# Altium project usb.PrjPcb
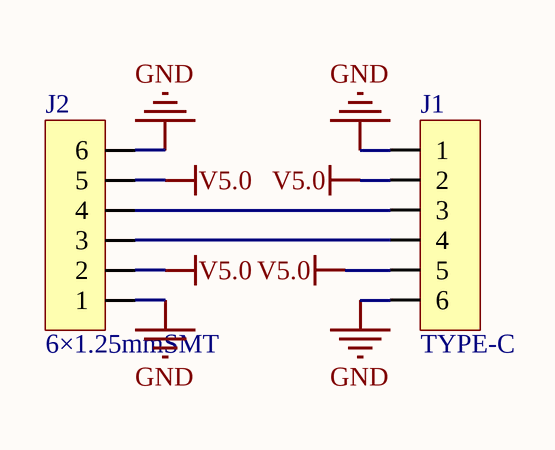
[diagram p0: USB.SchDoc]
1 sheet, 2 parts. Net scope: global (net labels, ports and power ports of the same name join across sheets).
Board file: USB_1.0_ZM_20210719.PcbDoc

## Sheet USB.SchDoc
size A4

### Parts
J1  TYPE-C  [USB-TYPE-C-6P]
J2  6×1.25mmSMT  [6×1.25mmSMT]

### Nets
GND: J1.1 J1.6 J2.1 J2.6
V5.0: J1.2 J1.5 J2.2 J2.5
NetJ1_3: J1.3 J2.4
NetJ1_4: J1.4 J2.3

### Library data of the parts
J1 J2 = SIP-6: USB 3.1 Type-C 2.0短体母座 6P贴片式